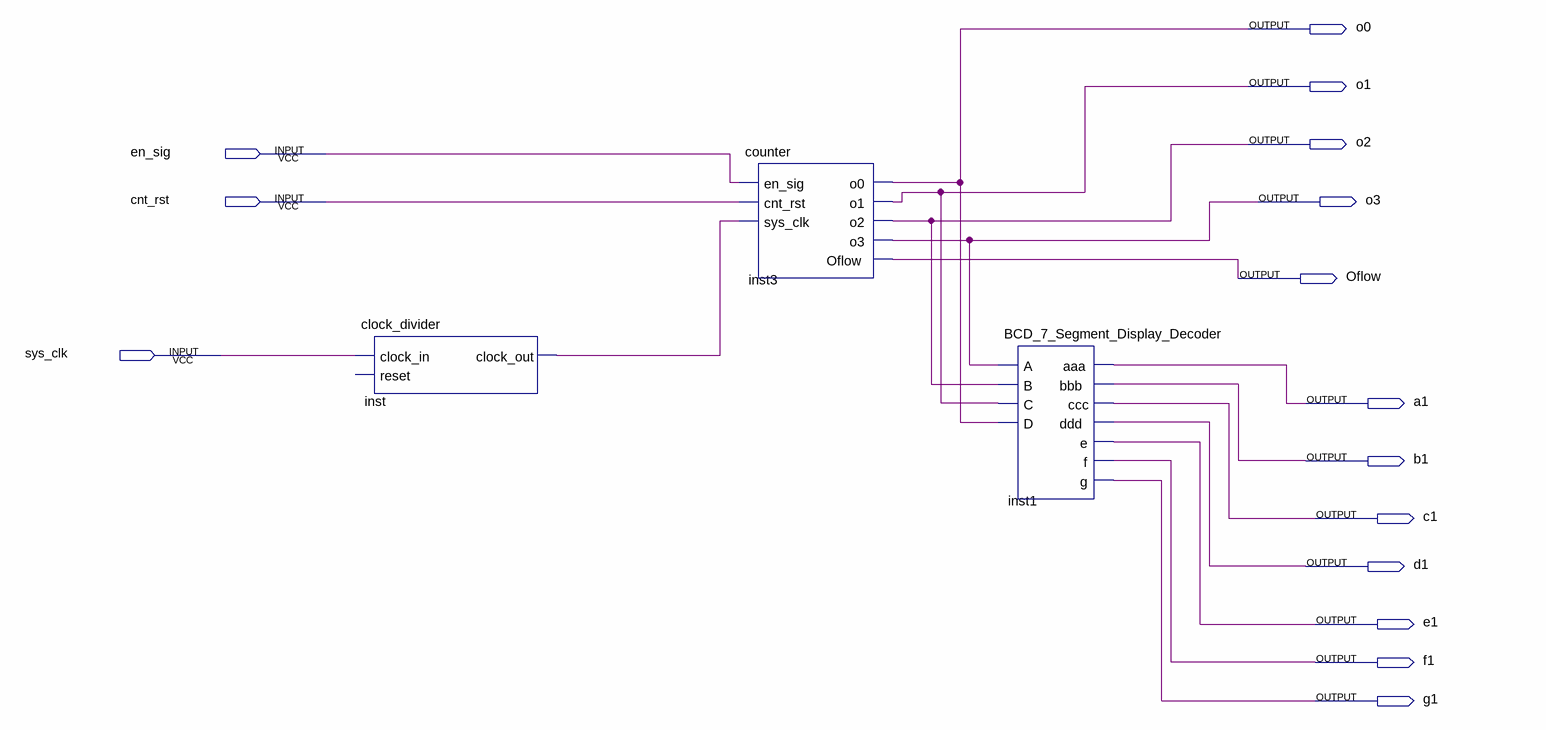
[diagram p0: schematic sheet]
// Quartus schematic full_counter_circuit.bdf as structural Verilog: 3 symbols, 15 pins
module full_counter_circuit (
  input  en_sig,
  input  cnt_rst,
  input  sys_clk,
  output o0,
  output o1,
  output o2,
  output o3,
  output Oflow,
  output a1,
  output b1,
  output c1,
  output d1,
  output e1,
  output f1,
  output g1
);

  wire inst_clock_out;

  clock_divider inst (.clock_in(sys_clk), .clock_out(inst_clock_out));  // open: reset
  counter inst3 (
    .en_sig(en_sig), .cnt_rst(cnt_rst), .sys_clk(inst_clock_out), .o0(o0), .o1(o1), .o2(o2), .o3(o3),
    .Oflow(Oflow));
  BCD_7_Segment_Display_Decoder inst1 (
    .A(o3), .B(o2), .C(o1), .D(o0), .aaa(a1), .bbb(b1), .ccc(c1), .ddd(d1), .e(e1), .f(f1), .g(g1));
endmodule
